# Altium schematic sheet [01] - COVER PAGE.SchDoc: Cover page
size A4; DocumentNumber: 1; SheetNumber: 1; SheetTotal: 4
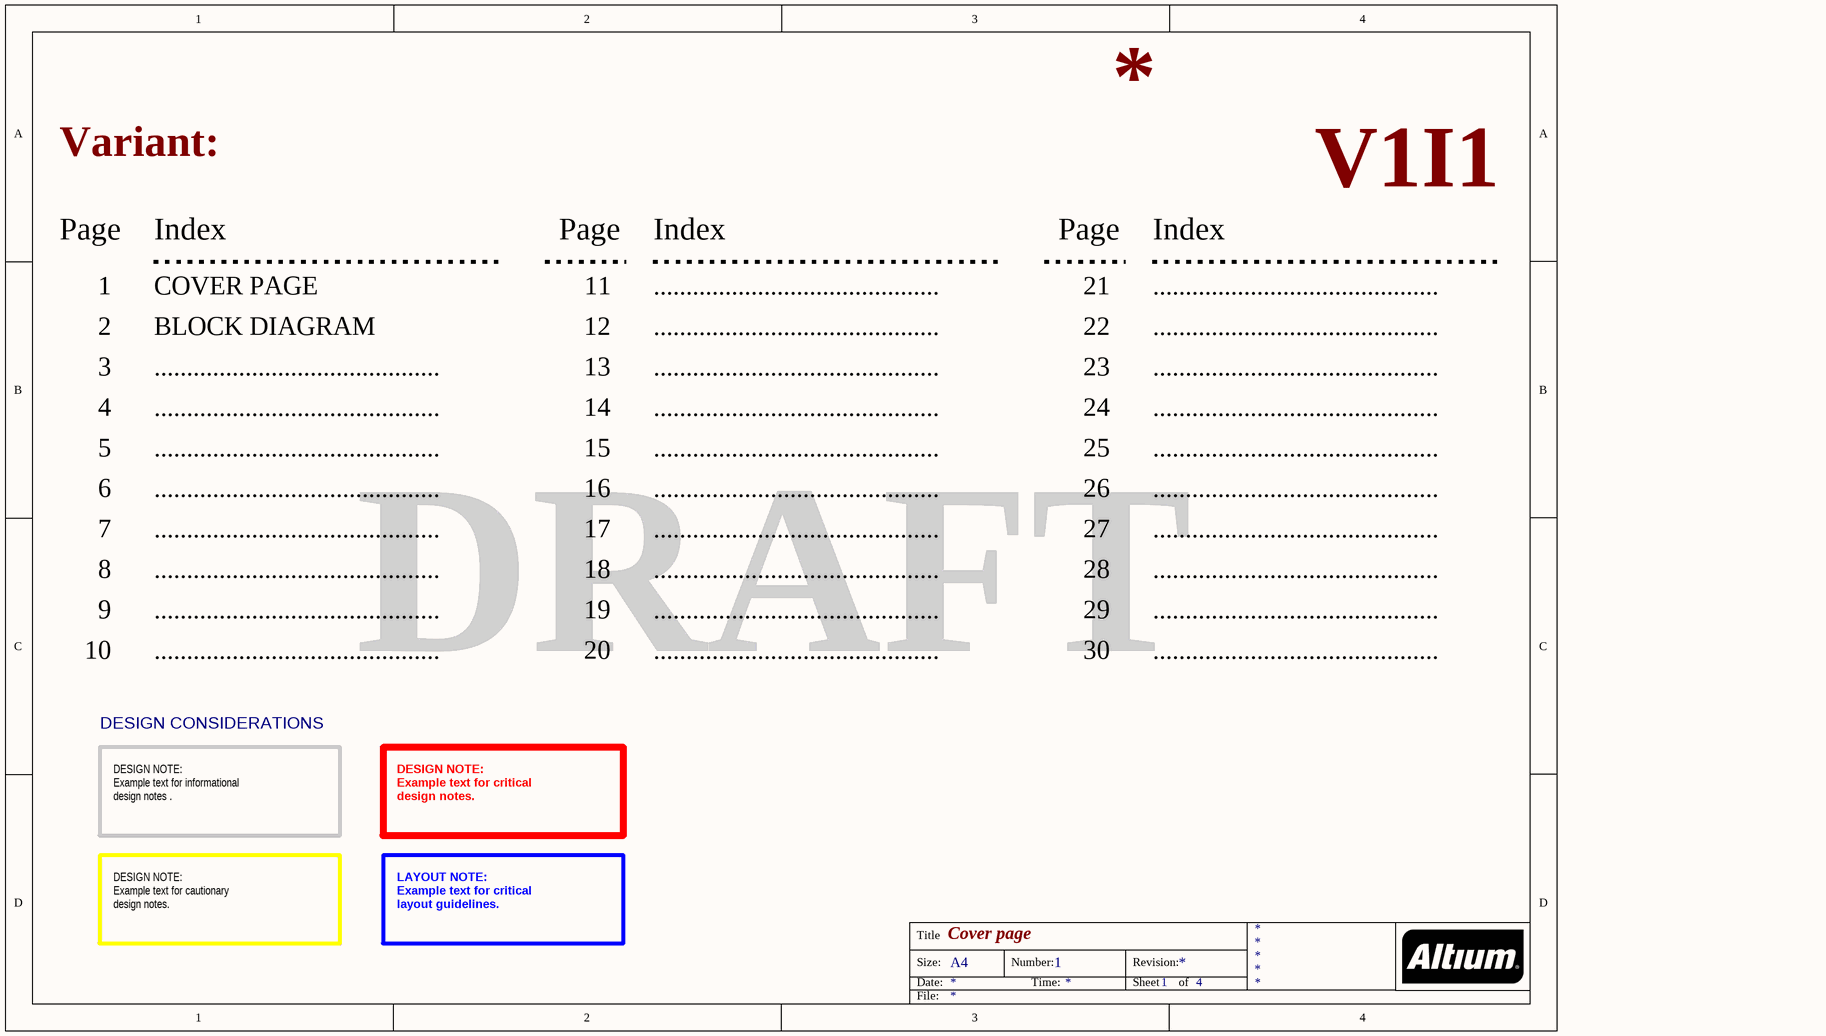
[diagram p0: [01] - COVER PAGE.SchDoc]

## Notes on the sheet
- Variant:
- Page
- Index
- V1I1
- 1
- COVER PAGE
- 11
- ............................................
- 21
- 2
- 3
- BLOCK DIAGRAM
- 12
- 13
- 22
- 23
- 4
- 14
- 24
- 5
- 6
- 15
- 16
- 25
- 26
- 7
- 8
- 17
- 18
- 27
- 28
- 9
- 19
- 29
- 10
- 20
- DRAFT
- 30
- DESIGN CONSIDERATIONS
- DESIGN NOTE:
  Example text for informational
  design notes .
- DESIGN NOTE:
  Example text for critical
  design notes.
- DESIGN NOTE:
  Example text for cautionary
  design notes.
- LAYOUT NOTE:
  Example text for critical
  layout guidelines.
- Title
- Size:
- Date:
- A4
- Number:
- Time:
- Revision:
- Sheet
- of
- File: